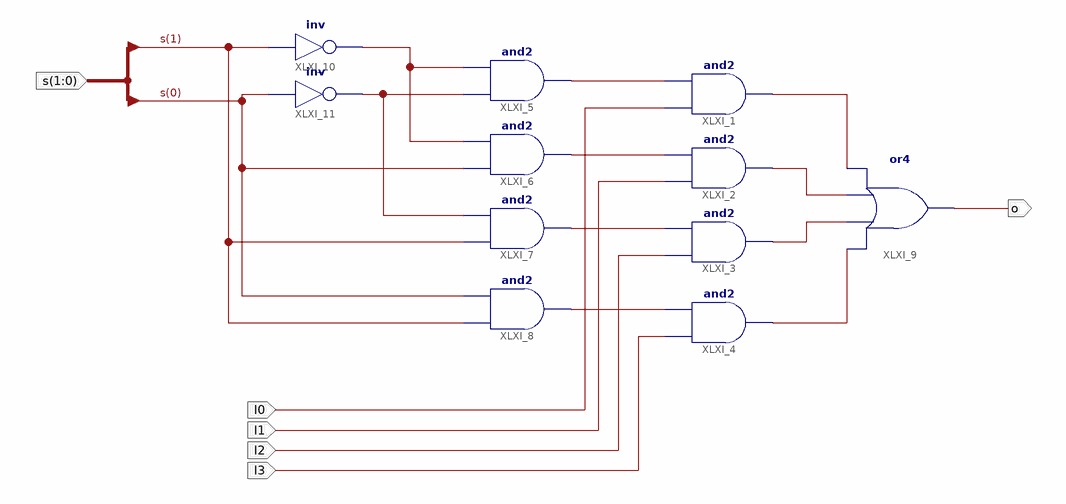
[diagram p0: schematic sheet 1]
// Xilinx ISE schematic Mux4to1.sch (kintex7) as structural Verilog: 11 symbols, 6 ports
module Mux4to1 (
  input  l0,
  input  l1,
  input  l2,
  input  l3,
  input  [1:0] s,
  output o
);

  wire XLXN_1, XLXN_2, XLXN_3, XLXN_4, XLXN_7, XLXN_8, XLXN_9, XLXN_27, XLXN_32, XLXN_39;

  and XLXI_2 (XLXN_2, l1, XLXN_7);
  and XLXI_3 (XLXN_3, l2, XLXN_8);
  and XLXI_4 (XLXN_4, l3, XLXN_9);
  and XLXI_1 (XLXN_1, l0, XLXN_39);
  and XLXI_5 (XLXN_39, XLXN_32, XLXN_27);
  and XLXI_6 (XLXN_7, s[0], XLXN_27);
  and XLXI_7 (XLXN_8, s[1], XLXN_32);
  and XLXI_8 (XLXN_9, s[1], s[0]);
  or XLXI_9 (o, XLXN_4, XLXN_3, XLXN_2, XLXN_1);
  not XLXI_10 (XLXN_27, s[1]);
  not XLXI_11 (XLXN_32, s[0]);
endmodule
